# Altium schematic sheet power_board_uC.SchDoc
size A4
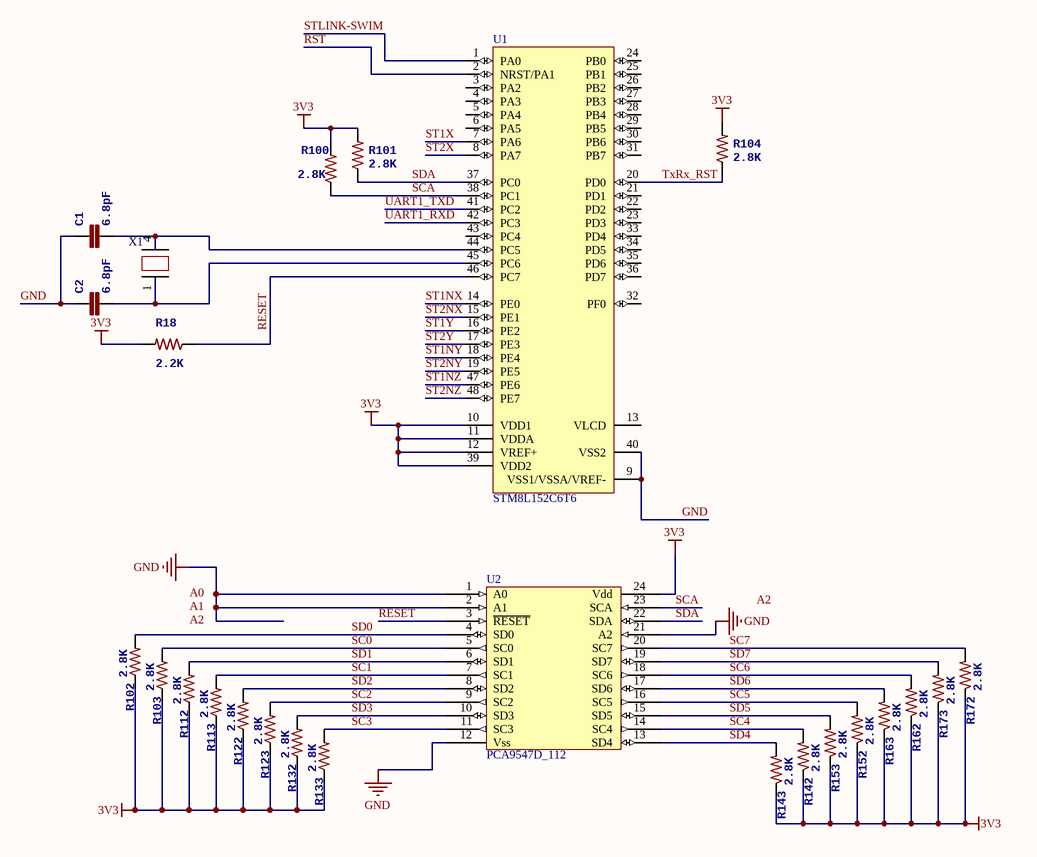
[diagram p0: power_board_uC.SchDoc]

## Parts
C1  6.8pF  [0402-CAP]
C2  6.8pF  [0402-CAP]
R18  2.2K  [0805]
R100  2.8K  [0805]
R101  2.8K  [0805]
R102  2.8K  [0805]
R103  2.8K  [0805]
R104  2.8K  [0805]
R112  2.8K  [0805]
R113  2.8K  [0805]
R122  2.8K  [0805]
R123  2.8K  [0805]
R132  2.8K  [0805]
R133  2.8K  [0805]
R142  2.8K  [0805]
R143  2.8K  [0805]
R152  2.8K  [0805]
R153  2.8K  [0805]
R162  2.8K  [0805]
R163  2.8K  [0805]
R172  2.8K  [0805]
R173  2.8K  [0805]
U1  STM8L152C6T6  [LQFP48_M]
U2  PCA9547D_112  [TSOP65P640X110-24N]
X1  XTAL_32MHz  [SOJ550P350X254-4M]  (value not drawn)

## Nets
3V3: R18.2 R100.2 R101.2 R102.1 R103.1 R104.2 R112.1 R113.1 R122.1 R123.1 R132.1 R133.1 R142.1 R143.1 R152.1 R153.1 R162.1 R163.1 R172.1 R173.1 U1.10(VDD1) U1.11(VDDA) U1.12(VREF+) U1.39(VDD2) U2.24(Vdd)
GND: C1.1 C2.1 U1.9(VSS1/VSSA/VREF-) U1.40(VSS2) U2.1(A0) U2.2(A1) U2.12(Vss) U2.21(A2)
RESET: R18.1 U1.46(PC7) U2.3(~{RESET})
RST: U1.2(NRST/PA1)
SC0: R103.2 U2.5(SC0)
SC1: R113.2 U2.7(SC1)
SC2: R123.2 U2.9(SC2)
SC3: R133.2 U2.11(SC3)
SC4: R142.2 U2.14(SC4)
SC5: R152.2 U2.16(SC5)
SC6: R162.2 U2.18(SC6)
SC7: R172.2 U2.20(SC7)
SCA: R100.1 U1.38(PC1) U2.23(SCA)
SD0: R102.2 U2.4(SD0)
SD1: R112.2 U2.6(SD1)
SD2: R122.2 U2.8(SD2)
SD3: R132.2 U2.10(SD3)
SD4: R143.2 U2.13(SD4)
SD5: R153.2 U2.15(SD5)
SD6: R163.2 U2.17(SD6)
SD7: R173.2 U2.19(SD7)
SDA: R101.1 U1.37(PC0) U2.22(SDA)
ST1NX: U1.14(PE0)
ST1NY: U1.18(PE4)
ST1NZ: U1.47(PE6)
ST1X: U1.7(PA6)
ST1Y: U1.16(PE2)
ST2NX: U1.15(PE1)
ST2NY: U1.19(PE5)
ST2NZ: U1.48(PE7)
ST2X: U1.8(PA7)
ST2Y: U1.17(PE3)
STLINK-SWIM: U1.1(PA0)
TxRx_RST: R104.1 U1.20(PD0)
UART1_RXD: U1.42(PC3)
UART1_TXD: U1.41(PC2)
NetC1_2: C1.2 U1.44(PC5) X1.4
NetC2_2: C2.2 U1.45(PC6) X1.1

Not connected (* = marked no-connect by the designer): U1 3(PA2) 4(PA3) 5(PA4) 6(PA5) 13(VLCD) 21(PD1) 22(PD2) 23(PD3) 24(PB0) 25(PB1) 26(PB2) 27(PB3) 28(PB4) 29(PB5) 30(PB6) 31(PB7) 32(PF0) 33(PD4) 34(PD5) 35(PD6) 36(PD7) 43(PC4)

## Notes on the sheet
- Labels drawn without touching a wire or pin: A0, A1, A2

## Library data of the parts
C1 C2 = CAP0402-6_8pF: Value: 6.8pF; Supplier 1: Digi-Key; Supplier Part Number 1: 490-5950-1-ND
R18 = RES_0805_2k2: Manufacturer: TE Connectivity; Manufacturer Part Number: 1625856-2; Resistance (Ohms): 100M; Tolerance: ±10%; Power (Watts): 0.125W, 1/8W; Temperature Coefficient: ±100ppm/°C; RoHS: RoHS Compliant; Category: Resistors; Packaging: Cut Tape (CT); Composition: Thick Film; Features: -; Operating Temperature: -55°C ~ 125°C; Package / Case: 0805 (2012 Metric); Supplier Device Package: 0805; Size / Dimension: 0.079" L x 0.047" W (2.00mm x 1.20mm); Height: 0.020" (0.50mm); Number of Terminations: 2; ComponentLink1URL: http://www.te.com/commerce/DocumentDelivery/DDEController?Action=srchrtrv&DocNm=1625856&DocType=Customer+Drawing&DocLang=English; ComponentLink1Description: http://www.te.com/commerce/DocumentDelivery/DDEController?Action=srchrtrv&DocNm=1625856&DocType=Customer+Drawing&DocLang=English; Value: 2.2K; Supplier 1: Digi-Key; Supplier Part Number 1: 311-42.2KCRCT-ND
R100-R104 R112 R113 R122 R123 R132 R133 R142 R143 R152 R153 R162 R163 R172 R173 = RES_0805_2k8: Manufacturer: TE Connectivity; Manufacturer Part Number: 1625856-2; Resistance (Ohms): 100M; Tolerance: ±10%; Power (Watts): 0.125W, 1/8W; Temperature Coefficient: ±100ppm/°C; RoHS: RoHS Compliant; Category: Resistors; Packaging: Cut Tape (CT); Composition: Thick Film; Features: -; Operating Temperature: -55°C ~ 125°C; Package / Case: 0805 (2012 Metric); Supplier Device Package: 0805; Size / Dimension: 0.079" L x 0.047" W (2.00mm x 1.20mm); Height: 0.020" (0.50mm); Number of Terminations: 2; ComponentLink1URL: http://www.te.com/commerce/DocumentDelivery/DDEController?Action=srchrtrv&DocNm=1625856&DocType=Customer+Drawing&DocLang=English; ComponentLink1Description: http://www.te.com/commerce/DocumentDelivery/DDEController?Action=srchrtrv&DocNm=1625856&DocType=Customer+Drawing&DocLang=English; Value: 2.8K; Supplier 1: Digi-Key; Supplier Part Number 1: P2.80KCCT-ND
U1 = CMP-0235-00048-1: STM8L ARM-based EnergyLite 8-bit MCU, LCD, 32 kB Flash, 2 kB Internal RAM, -40 to +85°C Temperature, 48-pin LQFP, Tray; ComponentLink1URL: http://www.st.com/internet/com/TECHNICAL_RESOURCES/TECHNICAL_LITERATURE/DATASHEET/CD00240181.pdf; ComponentLink2Description: STM8L Family Web Page; ComponentLink3URL: http://www.st.com/internet/com/home/home.jsp; ComponentLink1Description: STM8L151/152,x4,x6 Datasheet; PackageVersion: rev13, Apr-2011; PackageDescription: 48-Pin Low-Profile Quad Flat Pack, 7 x 7 mm Body, 0.5 mm Pitch (LQFP48); PackageReference: LQFP48; ComponentLink2URL: http://www.st.com/internet/mcu/subclass/1381.jsp; ComponentLink3Description: st.com Home; Supplier 1: Digi-Key; Supplier Part Number 1: 497-10512-ND
U2 = PCA9547D_112: Supplier 1: Digi-Key; Supplier Part Number 1: 568-11921-1-ND
X1 = XTAL_32MHz: Supplier 1: Digi-Key; Supplier Part Number 1: SER2417CT-ND